# Altium schematic sheet Input_Analog.SchDoc
size A4
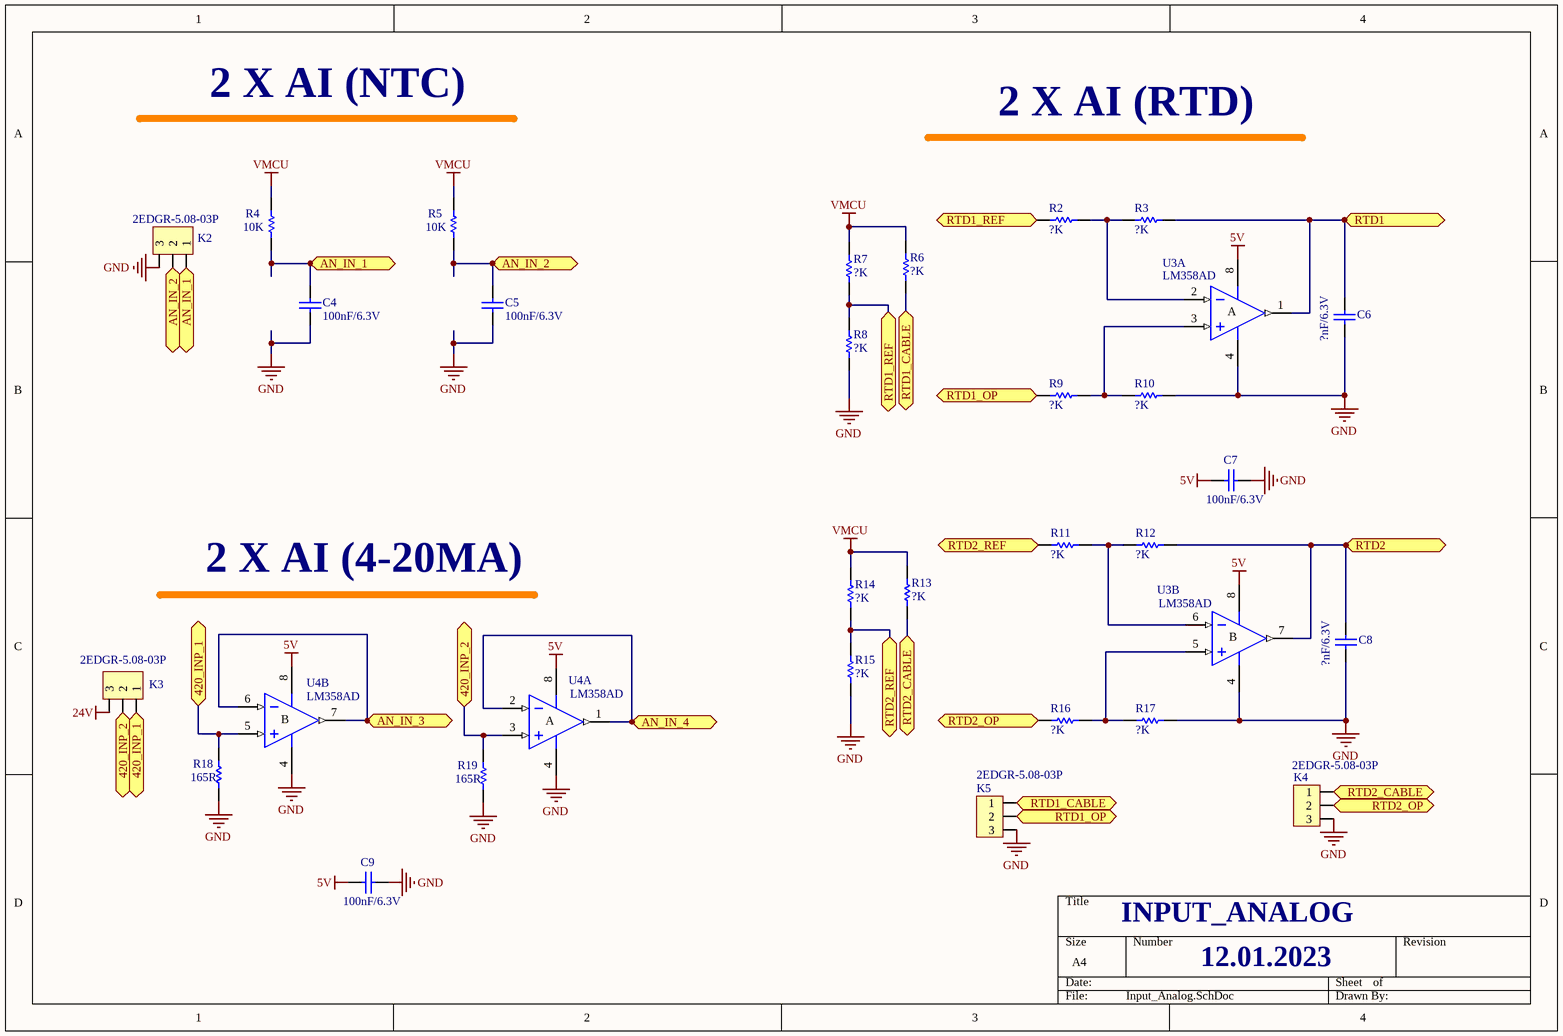
[diagram p0: Input_Analog.SchDoc]

## Parts
C4  100nF/6.3V  [CAP0603W]
C5  100nF/6.3V  [CAP0603W]
C6  ?nF/6.3V  [CAP0603W]
C7  100nF/6.3V  [CAP0603W]
C8  ?nF/6.3V  [CAP0603W]
C9  100nF/6.3V  [CAP0603W]
K2  2EDGR-5.08-03P  [CON_DG129_03P]
K3  2EDGR-5.08-03P  [CON_DG129_03P]
K4  2EDGR-5.08-03P  [CON_DG129_03P]
K5  2EDGR-5.08-03P  [CON_DG129_03P]
R2  ?K  [RES1608[0603]]
R3  ?K  [RES1608[0603]]
R4  10K  [RES1608[0603]]
R5  10K  [RES1608[0603]]
R6  ?K  [RES1608[0603]]
R7  ?K  [RES1608[0603]]
R8  ?K  [RES1608[0603]]
R9  ?K  [RES1608[0603]]
R10  ?K  [RES1608[0603]]
R11  ?K  [RES1608[0603]]
R12  ?K  [RES1608[0603]]
R13  ?K  [RES1608[0603]]
R14  ?K  [RES1608[0603]]
R15  ?K  [RES1608[0603]]
R16  ?K  [RES1608[0603]]
R17  ?K  [RES1608[0603]]
R18  165R  [RES1608[0603]]
R19  165R  [RES1608[0603]]
U3  LM358AD  [SO8]  (parts A,B of 2)
U4  LM358AD  [SO8]  (parts A,B of 2)

## Ports
420_INP_1, 420_INP_2, AN_IN_1, AN_IN_2, AN_IN_3, AN_IN_4, RTD1, RTD1_CABLE, RTD1_OP, RTD1_REF, RTD2, RTD2_CABLE, RTD2_OP, RTD2_REF

## Nets
5V: C7.1 C9.1 U3.8(V+) U4.8(V+)
24V: K3.3
GND: C4.2 C5.2 C6.2 C7.2 C8.2 C9.2 K2.3 K4.3 K5.3 R8.1 R10.1 R15.1 R17.1 R18.2 R19.2 U3.4(V-) U4.4(V-)
VMCU: R4.1 R5.1 R6.2 R7.2 R13.2 R14.2
420_INP_1: K3.1 R18.1 U4.5(IN+) ; port 420_INP_1
420_INP_2: K3.2 R19.1 U4.3(IN+) ; port 420_INP_2
AN_IN_1: C4.1 K2.1 R4.2 ; port AN_IN_1
AN_IN_2: C5.1 K2.2 R5.2 ; port AN_IN_2
AN_IN_3: U4.6(IN-) U4.7(OUT) ; port AN_IN_3
AN_IN_4: U4.1(OUT) U4.2(IN-) ; port AN_IN_4
RTD1: C6.1 R3.1 U3.1(OUT) ; port RTD1
RTD1_CABLE: K5.1 R6.1 ; port RTD1_CABLE
RTD1_OP: K5.2 R9.2 ; port RTD1_OP
RTD1_REF: R2.2 R7.1 R8.2 ; port RTD1_REF
RTD2: C8.1 R12.1 U3.7(OUT) ; port RTD2
RTD2_CABLE: K4.1 R13.1 ; port RTD2_CABLE
RTD2_OP: K4.2 R16.2 ; port RTD2_OP
RTD2_REF: R11.2 R14.1 R15.2 ; port RTD2_REF
NetR2_1: R2.1 R3.2 U3.2(IN-)
NetR9_1: R9.1 R10.2 U3.3(IN+)
NetR11_1: R11.1 R12.2 U3.6(IN-)
NetR16_1: R16.1 R17.2 U3.5(IN+)

## Notes on the sheet
- 2 X AI (NTC)
- 2 X AI (RTD)
- 2 X AI (4-20MA)
- INPUT_ANALOG
- 12.01.2023
- (in symbol LM358AD, part A) A
- (in symbol LM358AD, part B) B

## Library data of the parts
C4-C9 = CAP1: CAPACITOR 0603 Case; Value: 100nF; Published: 8-Jun-2000; LatestRevisionDate: 17-Jul-2002; LatestRevisionNote: Re-released for DXP Platform.; PackageReference: C1206; Publisher: Altium Limited
K2-K5 = KLEMENS_3P: CONNECTOR 5.08mm 3PIN 90DEG
R2-R19 = RES: RESISTOR 0603 Case %1; Value: 430R; Published: 8-Jun-2000; LatestRevisionDate: 17-Jul-2002; LatestRevisionNote: Re-released for DXP Platform.; PackageReference: AXIAL-0.5; Publisher: Altium Limited
U3 = LM358AD: OPAMP Low-Power Dual Operational Amplifier; Published: 24-Aug-2001; LatestRevisionDate: 13-Apr-2006; LatestRevisionNote: IPC-7351 Footprint Added.; DatasheetVersion: Jun-1998; PackageVersion: Dec-2002; PackageReference: SO8; Publisher: Altium Limited; PackageDescription: 8-Pin Small Outline Integrated Circuit 1.27 mm Pitch; Code_JEDEC: MS-012-AA; Code_IPC: SOIC127P600-8; ComponentLink1Description: Manufacturer Link; ComponentLink1URL: http://www.st.com/; ComponentLink2Description: Datasheet; ComponentLink2URL: http://www.st.com/stonline/products/literature/ds/2163/lm358.pdf
U4 = LM358AD: Low-Power Dual Operational Amplifier; Published: 24-Aug-2001; LatestRevisionDate: 13-Apr-2006; LatestRevisionNote: IPC-7351 Footprint Added.; DatasheetVersion: Jun-1998; PackageVersion: Dec-2002; PackageReference: SO8; Publisher: Altium Limited; PackageDescription: 8-Pin Small Outline Integrated Circuit 1.27 mm Pitch; Code_JEDEC: MS-012-AA; Code_IPC: SOIC127P600-8; ComponentLink1Description: Manufacturer Link; ComponentLink1URL: http://www.st.com/; ComponentLink2Description: Datasheet; ComponentLink2URL: http://www.st.com/stonline/products/literature/ds/2163/lm358.pdf